# EAGLE design untitled (EAGLE 9.6.2)
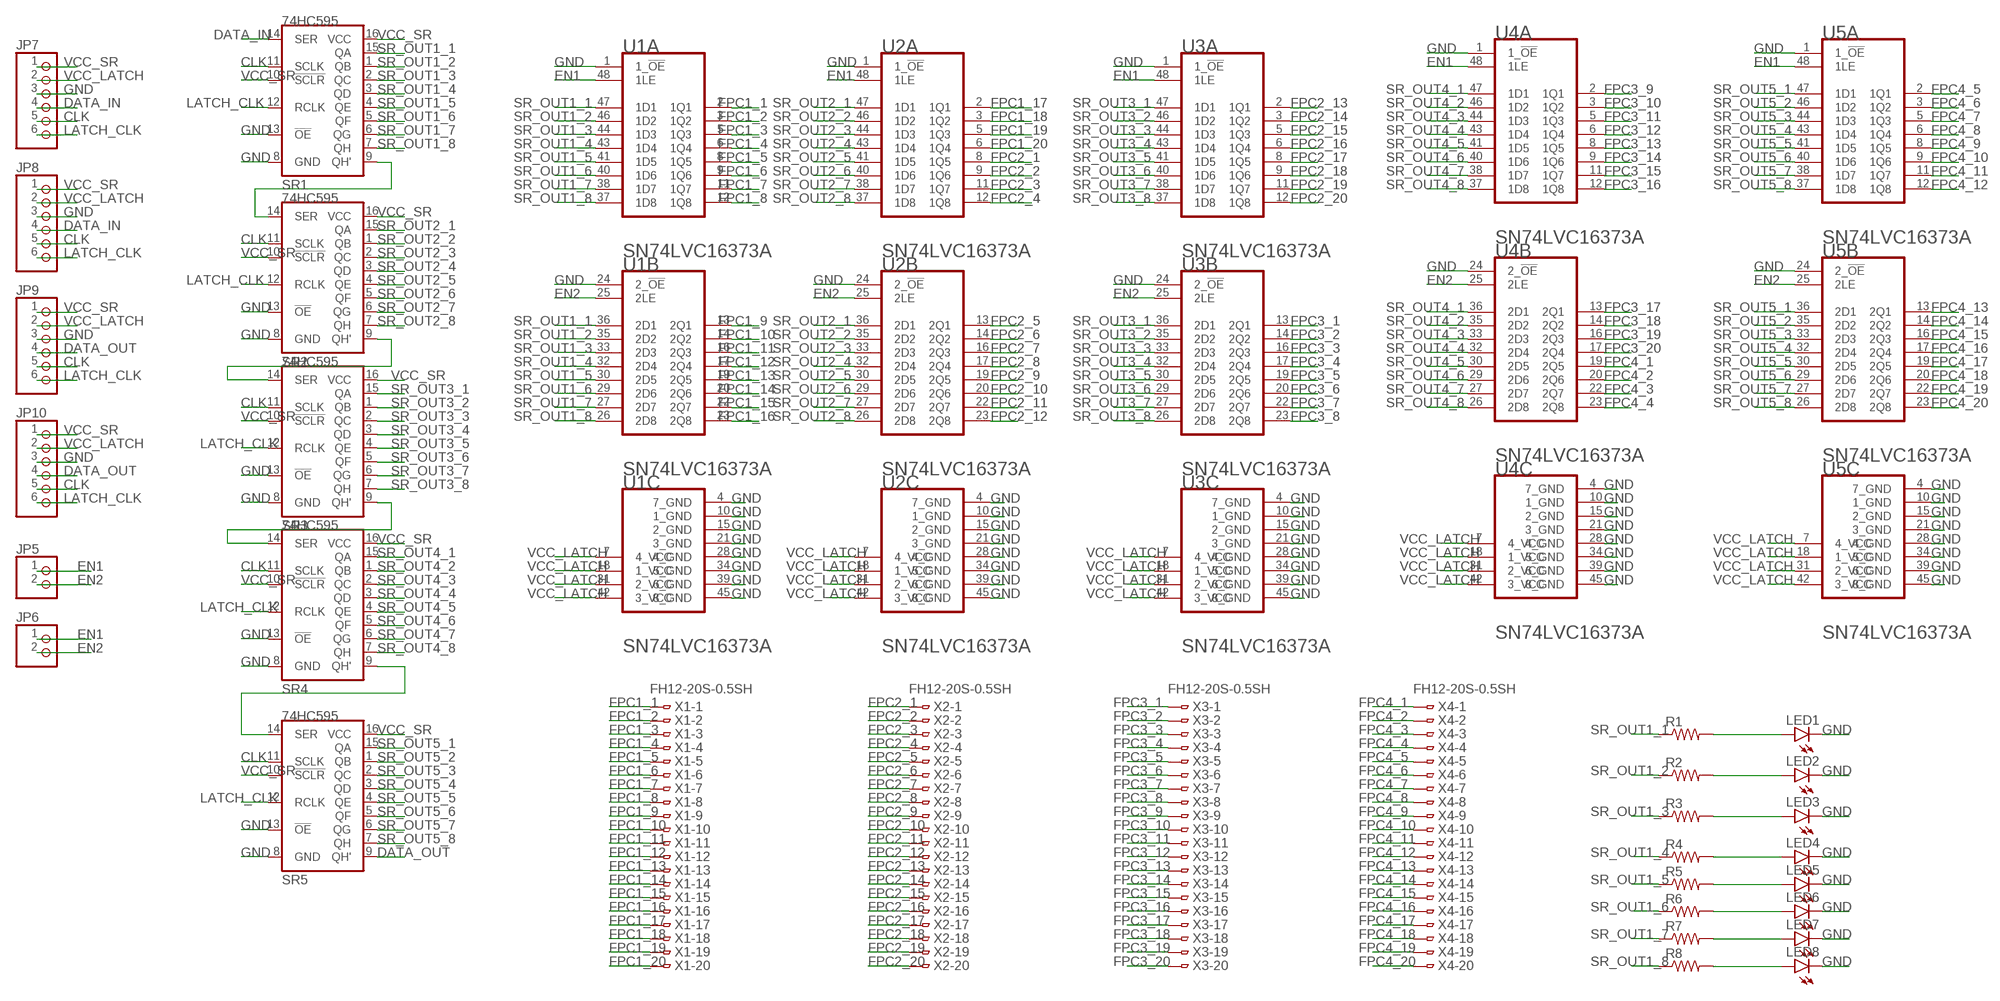
[diagram p0: schematic, sheet 1]

## Parts
JP5  PINHD-1X2  [1X02]
JP6  PINHD-1X2  [1X02]
JP7  PINHD-1X6  [1X06]
JP8  PINHD-1X6  [1X06]
JP9  PINHD-1X6  [1X06]
JP10  PINHD-1X6  [1X06]
LED1  LEDCHIP-LED0805  [CHIP-LED0805]
LED2  LEDCHIP-LED0805  [CHIP-LED0805]
LED3  LEDCHIP-LED0805  [CHIP-LED0805]
LED4  LEDCHIP-LED0805  [CHIP-LED0805]
LED5  LEDCHIP-LED0805  [CHIP-LED0805]
LED6  LEDCHIP-LED0805  [CHIP-LED0805]
LED7  LEDCHIP-LED0805  [CHIP-LED0805]
LED8  LEDCHIP-LED0805  [CHIP-LED0805]
R1  R-US_R0805  [R0805]
R2  R-US_R0805  [R0805]
R3  R-US_R0805  [R0805]
R4  R-US_R0805  [R0805]
R5  R-US_R0805  [R0805]
R6  R-US_R0805  [R0805]
R7  R-US_R0805  [R0805]
R8  R-US_R0805  [R0805]
SR1  74HC595  [SO16]
SR2  74HC595  [SO16]
SR3  74HC595  [SO16]
SR4  74HC595  [SO16]
SR5  74HC595  [SO16]
U1  TEXAS_INSTRUMENTS_SN74LVC16373ATEXAS_INSTRUMENTS_SN74LVC16373A_0_2  [TEXAS_INSTRUMENTS_SN74LVC16373A_2]
U2  TEXAS_INSTRUMENTS_SN74LVC16373ATEXAS_INSTRUMENTS_SN74LVC16373A_0_2  [TEXAS_INSTRUMENTS_SN74LVC16373A_2]
U3  TEXAS_INSTRUMENTS_SN74LVC16373ATEXAS_INSTRUMENTS_SN74LVC16373A_0_2  [TEXAS_INSTRUMENTS_SN74LVC16373A_2]
U4  TEXAS_INSTRUMENTS_SN74LVC16373ATEXAS_INSTRUMENTS_SN74LVC16373A_0_2  [TEXAS_INSTRUMENTS_SN74LVC16373A_2]
U5  TEXAS_INSTRUMENTS_SN74LVC16373ATEXAS_INSTRUMENTS_SN74LVC16373A_0_2  [TEXAS_INSTRUMENTS_SN74LVC16373A_2]
X1  FH12-20S-0.5SH  [FH12-20S-0.5SH]
X2  FH12-20S-0.5SH  [FH12-20S-0.5SH]
X3  FH12-20S-0.5SH  [FH12-20S-0.5SH]
X4  FH12-20S-0.5SH  [FH12-20S-0.5SH]

## Nets
CLK: JP7.5 JP8.5 JP9.5 JP10.5 SR1.11(SCLK) SR2.11(SCLK) SR3.11(SCLK) SR4.11(SCLK) SR5.11(SCLK)
DATA_IN: JP7.4 JP8.4 SR1.14(SER)
DATA_OUT: JP9.4 JP10.4 SR5.9(QH')
EN1: JP5.1 JP6.1 U1.48(A:1LE) U2.48(A:1LE) U3.48(A:1LE) U4.48(A:1LE) U5.48(A:1LE)
EN2: JP5.2 JP6.2 U1.25(B:2LE) U2.25(B:2LE) U3.25(B:2LE) U4.25(B:2LE) U5.25(B:2LE)
FPC1_1: U1.2(A:1Q1) X1.1
FPC1_2: U1.3(A:1Q2) X1.2
FPC1_3: U1.5(A:1Q3) X1.3
FPC1_4: U1.6(A:1Q4) X1.4
FPC1_5: U1.8(A:1Q5) X1.5
FPC1_6: U1.9(A:1Q6) X1.6
FPC1_7: U1.11(A:1Q7) X1.7
FPC1_8: U1.12(A:1Q8) X1.8
FPC1_9: U1.13(B:2Q1) X1.9
FPC1_10: U1.14(B:2Q2) X1.10
FPC1_11: U1.16(B:2Q3) X1.11
FPC1_12: U1.17(B:2Q4) X1.12
FPC1_13: U1.19(B:2Q5) X1.13
FPC1_14: U1.20(B:2Q6) X1.14
FPC1_15: U1.22(B:2Q7) X1.15
FPC1_16: U1.23(B:2Q8) X1.16
FPC1_17: U2.2(A:1Q1) X1.17
FPC1_18: U2.3(A:1Q2) X1.18
FPC1_19: U2.5(A:1Q3) X1.19
FPC1_20: U2.6(A:1Q4) X1.20
FPC2_1: U2.8(A:1Q5) X2.1
FPC2_2: U2.9(A:1Q6) X2.2
FPC2_3: U2.11(A:1Q7) X2.3
FPC2_4: U2.12(A:1Q8) X2.4
FPC2_5: U2.13(B:2Q1) X2.5
FPC2_6: U2.14(B:2Q2) X2.6
FPC2_7: U2.16(B:2Q3) X2.7
FPC2_8: U2.17(B:2Q4) X2.8
FPC2_9: U2.19(B:2Q5) X2.9
FPC2_10: U2.20(B:2Q6) X2.10
FPC2_11: U2.22(B:2Q7) X2.11
FPC2_12: U2.23(B:2Q8) X2.12
FPC2_13: U3.2(A:1Q1) X2.13
FPC2_14: U3.3(A:1Q2) X2.14
FPC2_15: U3.5(A:1Q3) X2.15
FPC2_16: U3.6(A:1Q4) X2.16
FPC2_17: U3.8(A:1Q5) X2.17
FPC2_18: U3.9(A:1Q6) X2.18
FPC2_19: U3.11(A:1Q7) X2.19
FPC2_20: U3.12(A:1Q8) X2.20
FPC3_1: U3.13(B:2Q1) X3.1
FPC3_2: U3.14(B:2Q2) X3.2
FPC3_3: U3.16(B:2Q3) X3.3
FPC3_4: U3.17(B:2Q4) X3.4
FPC3_5: U3.19(B:2Q5) X3.5
FPC3_6: U3.20(B:2Q6) X3.6
FPC3_7: U3.22(B:2Q7) X3.7
FPC3_8: U3.23(B:2Q8) X3.8
FPC3_9: U4.2(A:1Q1) X3.9
FPC3_10: U4.3(A:1Q2) X3.10
FPC3_11: U4.5(A:1Q3) X3.11
FPC3_12: U4.6(A:1Q4) X3.12
FPC3_13: U4.8(A:1Q5) X3.13
FPC3_14: U4.9(A:1Q6) X3.14
FPC3_15: U4.11(A:1Q7) X3.15
FPC3_16: U4.12(A:1Q8) X3.16
FPC3_17: U4.13(B:2Q1) X3.17
FPC3_18: U4.14(B:2Q2) X3.18
FPC3_19: U4.16(B:2Q3) X3.19
FPC3_20: U4.17(B:2Q4) X3.20
FPC4_1: U4.19(B:2Q5) X4.1
FPC4_2: U4.20(B:2Q6) X4.2
FPC4_3: U4.22(B:2Q7) X4.3
FPC4_4: U4.23(B:2Q8) X4.4
FPC4_5: U5.2(A:1Q1) X4.5
FPC4_6: U5.3(A:1Q2) X4.6
FPC4_7: U5.5(A:1Q3) X4.7
FPC4_8: U5.6(A:1Q4) X4.8
FPC4_9: U5.8(A:1Q5) X4.9
FPC4_10: U5.9(A:1Q6) X4.10
FPC4_11: U5.11(A:1Q7) X4.11
FPC4_12: U5.12(A:1Q8) X4.12
FPC4_13: U5.13(B:2Q1) X4.13
FPC4_14: U5.14(B:2Q2) X4.14
FPC4_15: U5.16(B:2Q3) X4.15
FPC4_16: U5.17(B:2Q4) X4.16
FPC4_17: U5.19(B:2Q5) X4.17
FPC4_18: U5.20(B:2Q6) X4.18
FPC4_19: U5.22(B:2Q7) X4.19
FPC4_20: U5.23(B:2Q8) X4.20
GND: JP7.3 JP8.3 JP9.3 JP10.3 LED1.C LED2.C LED3.C LED4.C LED5.C LED6.C LED7.C LED8.C SR1.8(GND) SR1.13(!OE) SR2.8(GND) SR2.13(!OE) SR3.8(GND) SR3.13(!OE) SR4.8(GND) SR4.13(!OE) SR5.8(GND) SR5.13(!OE) U1.1(A:1_!OE!) U1.4(C:7_GND) U1.10(C:1_GND) U1.15(C:2_GND) U1.21(C:3_GND) U1.24(B:2_!OE!) U1.28(C:4_GND) U1.34(C:5_GND) U1.39(C:6_GND) U1.45(C:8_GND) U2.1(A:1_!OE!) U2.4(C:7_GND) U2.10(C:1_GND) U2.15(C:2_GND) U2.21(C:3_GND) U2.24(B:2_!OE!) U2.28(C:4_GND) U2.34(C:5_GND) U2.39(C:6_GND) U2.45(C:8_GND) U3.1(A:1_!OE!) U3.4(C:7_GND) U3.10(C:1_GND) U3.15(C:2_GND) U3.21(C:3_GND) U3.24(B:2_!OE!) U3.28(C:4_GND) U3.34(C:5_GND) U3.39(C:6_GND) U3.45(C:8_GND) U4.1(A:1_!OE!) U4.4(C:7_GND) U4.10(C:1_GND) U4.15(C:2_GND) U4.21(C:3_GND) U4.24(B:2_!OE!) U4.28(C:4_GND) U4.34(C:5_GND) U4.39(C:6_GND) U4.45(C:8_GND) U5.1(A:1_!OE!) U5.4(C:7_GND) U5.10(C:1_GND) U5.15(C:2_GND) U5.21(C:3_GND) U5.24(B:2_!OE!) U5.28(C:4_GND) U5.34(C:5_GND) U5.39(C:6_GND) U5.45(C:8_GND)
LATCH_CLK: JP7.6 JP8.6 JP9.6 JP10.6 SR1.12(RCLK) SR2.12(RCLK) SR3.12(RCLK) SR4.12(RCLK) SR5.12(RCLK)
N$1: SR1.9(QH') SR2.14(SER)
N$2: SR4.9(QH') SR5.14(SER)
N$3: LED1.A R1.2
N$4: LED2.A R2.2
N$5: LED3.A R3.2
N$6: LED4.A R4.2
N$7: LED5.A R5.2
N$8: SR2.9(QH') SR3.14(SER)
N$9: LED6.A R6.2
N$10: LED7.A R7.2
N$11: LED8.A R8.2
N$15: SR3.9(QH') SR4.14(SER)
SR_OUT1_1: R1.1 SR1.15(QA) U1.36(B:2D1) U1.47(A:1D1)
SR_OUT1_2: R2.1 SR1.1(QB) U1.35(B:2D2) U1.46(A:1D2)
SR_OUT1_3: R3.1 SR1.2(QC) U1.33(B:2D3) U1.44(A:1D3)
SR_OUT1_4: R4.1 SR1.3(QD) U1.32(B:2D4) U1.43(A:1D4)
SR_OUT1_5: R5.1 SR1.4(QE) U1.30(B:2D5) U1.41(A:1D5)
SR_OUT1_6: R6.1 SR1.5(QF) U1.29(B:2D6) U1.40(A:1D6)
SR_OUT1_7: R7.1 SR1.6(QG) U1.27(B:2D7) U1.38(A:1D7)
SR_OUT1_8: R8.1 SR1.7(QH) U1.26(B:2D8) U1.37(A:1D8)
SR_OUT2_1: SR2.15(QA) U2.36(B:2D1) U2.47(A:1D1)
SR_OUT2_2: SR2.1(QB) U2.35(B:2D2) U2.46(A:1D2)
SR_OUT2_3: SR2.2(QC) U2.33(B:2D3) U2.44(A:1D3)
SR_OUT2_4: SR2.3(QD) U2.32(B:2D4) U2.43(A:1D4)
SR_OUT2_5: SR2.4(QE) U2.30(B:2D5) U2.41(A:1D5)
SR_OUT2_6: SR2.5(QF) U2.29(B:2D6) U2.40(A:1D6)
SR_OUT2_7: SR2.6(QG) U2.27(B:2D7) U2.38(A:1D7)
SR_OUT2_8: SR2.7(QH) U2.26(B:2D8) U2.37(A:1D8)
SR_OUT3_1: SR3.15(QA) U3.36(B:2D1) U3.47(A:1D1)
SR_OUT3_2: SR3.1(QB) U3.35(B:2D2) U3.46(A:1D2)
SR_OUT3_3: SR3.2(QC) U3.33(B:2D3) U3.44(A:1D3)
SR_OUT3_4: SR3.3(QD) U3.32(B:2D4) U3.43(A:1D4)
SR_OUT3_5: SR3.4(QE) U3.30(B:2D5) U3.41(A:1D5)
SR_OUT3_6: SR3.5(QF) U3.29(B:2D6) U3.40(A:1D6)
SR_OUT3_7: SR3.6(QG) U3.27(B:2D7) U3.38(A:1D7)
SR_OUT3_8: SR3.7(QH) U3.26(B:2D8) U3.37(A:1D8)
SR_OUT4_1: SR4.15(QA) U4.36(B:2D1) U4.47(A:1D1)
SR_OUT4_2: SR4.1(QB) U4.35(B:2D2) U4.46(A:1D2)
SR_OUT4_3: SR4.2(QC) U4.33(B:2D3) U4.44(A:1D3)
SR_OUT4_4: SR4.3(QD) U4.32(B:2D4) U4.43(A:1D4)
SR_OUT4_5: SR4.4(QE) U4.30(B:2D5) U4.41(A:1D5)
SR_OUT4_6: SR4.5(QF) U4.29(B:2D6) U4.40(A:1D6)
SR_OUT4_7: SR4.6(QG) U4.27(B:2D7) U4.38(A:1D7)
SR_OUT4_8: SR4.7(QH) U4.26(B:2D8) U4.37(A:1D8)
SR_OUT5_1: SR5.15(QA) U5.36(B:2D1) U5.47(A:1D1)
SR_OUT5_2: SR5.1(QB) U5.35(B:2D2) U5.46(A:1D2)
SR_OUT5_3: SR5.2(QC) U5.33(B:2D3) U5.44(A:1D3)
SR_OUT5_4: SR5.3(QD) U5.32(B:2D4) U5.43(A:1D4)
SR_OUT5_5: SR5.4(QE) U5.30(B:2D5) U5.41(A:1D5)
SR_OUT5_6: SR5.5(QF) U5.29(B:2D6) U5.40(A:1D6)
SR_OUT5_7: SR5.6(QG) U5.27(B:2D7) U5.38(A:1D7)
SR_OUT5_8: SR5.7(QH) U5.26(B:2D8) U5.37(A:1D8)
VCC_LATCH: JP7.2 JP8.2 JP9.2 JP10.2 U1.7(C:4_VCC) U1.18(C:1_VCC) U1.31(C:2_VCC) U1.42(C:3_VCC) U2.7(C:4_VCC) U2.18(C:1_VCC) U2.31(C:2_VCC) U2.42(C:3_VCC) U3.7(C:4_VCC) U3.18(C:1_VCC) U3.31(C:2_VCC) U3.42(C:3_VCC) U4.7(C:4_VCC) U4.18(C:1_VCC) U4.31(C:2_VCC) U4.42(C:3_VCC) U5.7(C:4_VCC) U5.18(C:1_VCC) U5.31(C:2_VCC) U5.42(C:3_VCC)
VCC_SR: JP7.1 JP8.1 JP9.1 JP10.1 SR1.10(!SCLR) SR1.16(VCC) SR2.10(!SCLR) SR2.16(VCC) SR3.10(!SCLR) SR3.16(VCC) SR4.10(!SCLR) SR4.16(VCC) SR5.10(!SCLR) SR5.16(VCC)

## Library data of the parts
JP5 JP6 = pinhead:PINHD-1X2: PIN HEADER
JP7-JP10 = pinhead:PINHD-1X6: PIN HEADER
LED1-LED8 = led:LED: LED OSRAM: - CHIPLED LG R971, LG N971, LY N971, LG Q971, LY Q971, LO R971, LY R971 LH N974, LH R974 LS Q976, LO Q976, LY Q976 LO Q996 - Hyper CHIPLED LW Q18S LB Q993, LB Q99A, LB R99A - SideLED LS A670, LO A670, LY A670, LG A670, LP A670 LB A673, LV A673, LT A673, LW A673 LH A674 LY A675 LS A676, LA A676, LO A676, LY A676, LW A676 LS A679, LY A679, LG A679 - Hyper Micro SIDELED® LS Y876, LA Y876, LO Y876, LY Y876 LT Y87S - SmartLED LW L88C, LW L88S LB L89C, LB L89S, LG L890 LS L89K, LO L89K, LY L89K LS L896, LA L896, LO L896, LY L896 - TOPLED LS T670, LO T670, LY T670, LG T670, LP T670 LSG T670, LSP T670, LSY T670, LOP T670, LYG T670 LG T671, LOG T671, LSG T671 LB T673, LV T673, LT T673, LW T673 LH T674 LS T676, LA T676, LO T676, LY T676, LB T676, LH T676, LSB T676, LW T676 LB T67C, LV T67C, LT T67C, LS T67K, LO T67K, LY T67K, LW E67C LS E67B, LA E67B, LO E67B, LY E67B, LB E67C, LV E67C, LT E67C LW T67C LS T679, LY T679, LG T679 LS T770, LO T770, LY T770, LG T770, LP T770 LB T773, LV T773, LT T773, LW T773 LH T774 LS E675, LA E675, LY E675, LS T675 LS T776, LA T776, LO T776, LY T776, LB T776 LHGB T686 LT T68C, LB T68C - Hyper Mini TOPLED® LB M676 - Mini TOPLED Santana® LG M470 LS M47K, LO M47K, LY M47K Source: http://www.osram.convergy.de LUXEON: - LUMILED® LXK2-PW12-R00, LXK2-PW12-S00, LXK2-PW14-U00, LXK2-PW14-V00 LXK2-PM12-R00, LXK2-PM12-S00, LXK2-PM14-U00 LXK2-PE12-Q00, LXK2-PE12-R00, LXK2-PE12-S00, LXK2-PE14-T00, LXK2-PE14-U00 LXK2-PB12-K00, LXK2-PB12-L00, LXK2-PB12-M00, LXK2-PB14-N00, LXK2-PB14-P00, LXK2-PB14-Q00 LXK2-PR12-L00, LXK2-PR12-M00, LXK2-PR14-Q00, LXK2-PR14-R00 LXK2-PD12-Q00, LXK2-PD12-R00, LXK2-PD12-S00 LXK2-PH12-R00, LXK2-PH12-S00 LXK2-PL12-P00, LXK2-PL12-Q00, LXK2-PL12-R00 Source: www.luxeon.com KINGBRIGHT: KA-3528ASYC Source: www.kingbright.com
R1-R8 = rcl:R-US_: RESISTOR, American symbol; SPICEPREFIX: R
SR1-SR5 = 74HC595:74HC595: 8-bit SHIFT REGISTER, output latch Check availability <https://pricing.snapeda.com/parts/74HC595/Nexperia/view-part?ref=eda>; AVAILABILITY: In Stock; DESCRIPTION: Shift Register Single 8-Bit Serial to Serial/Parallel 16-Pin SSOP T/R; MF: Nexperia; MP: 74HC595; PACKAGE: None; PRICE: None
U1-U5 = SN74LVC16373A(NEW_16BIT_LATCH):TEXAS_INSTRUMENTS_SN74LVC16373A: TI-SN54_74XXXXX16X373X-48; 3_STATE_OUTPUT: Yes; BITS: 16; CIIVA_IDS: 19307467; CODE__JEDEC: MO-153; DATASHEET_VERSION: SCAS755B; FOOTPRINT_VARIANT_NAME_0: Level C; FOOTPRINT_VARIANT_NAME_1: Level B; FOOTPRINT_VARIANT_NAME_2: Level A; F__NOM_VOLTAGEMAXMHZ: 100; ICC__NOM_VOLTAGEMAXMA: 0.02; IMPORTED: yes; IMPORTED_FROM: vault; IMPORT_TS: 1521844253; INPUT_TYPE: CMOS,TTL; LOGIC: true; MF: Texas Instruments; MPN: SN74LVC16373A; OPERATING_TEMPERATURE_RANGEC: -40 to 125,-40 to 85; OUTPUT_DRIVE_IOLIOHMAXMA: 24/-24; OUTPUT_LOGIC: Non-inverted; OUTPUT_TYPE: CMOS; PACKAGE: DGG0048A; PREFIX: U; RATING: Catalog; RELEASE_DATE: 1459328133; SCHMITT_TRIGGER: No; STATIC_CURRENT: 0.02; TECHNOLOGY_FAMILY: LVC; TPD__NOM_VOLTAGEMAXNS: 6.4,4.2,4.9; VAULT_GUID: 00FB3570-8383-4C82-A038-A58A20934C8C; VAULT_REVISION: B0EE8CD6-9ACA-4FFF-ACFC-C0240CF4C59E; VCC_MAX_V: 3.6; VCC_MIN_V: 1.65; VOLTAGE_NOM_V: 1.8,2.5,2.7,3.3
X1-X4 = con-hirose:FH12-20S-0.5S: 0.5mm Pitch Connectors For FPC/FFC Source: Data sheet <http://www.hirose.co.jp/cataloge_hp/e58605370.pdf>; MPN: FH12-20S-0.5SH(55); OC_FARNELL: 1324549; OC_NEWARK: 34M6166

## Board
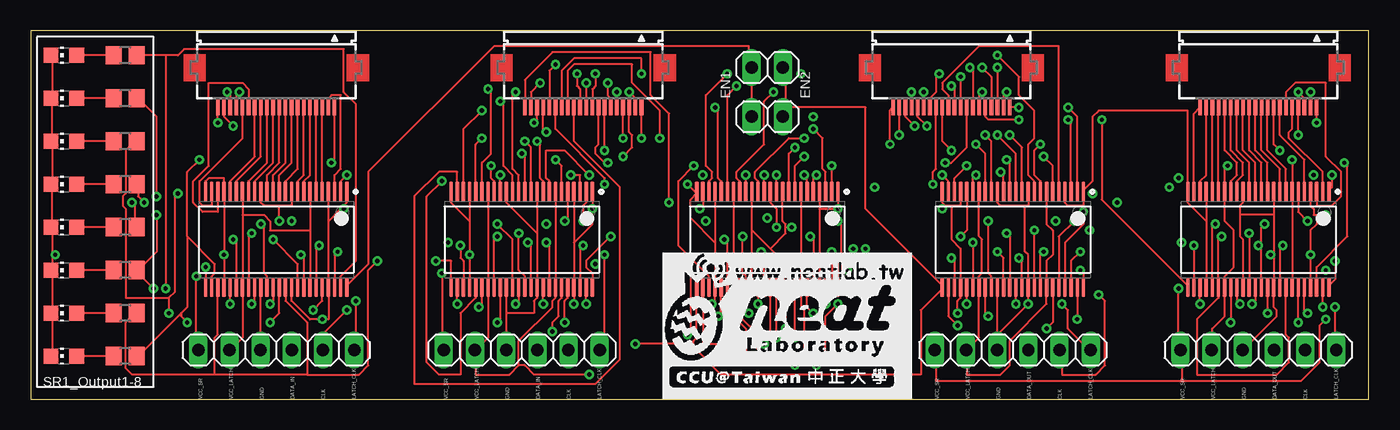
[diagram p1: board, top side]
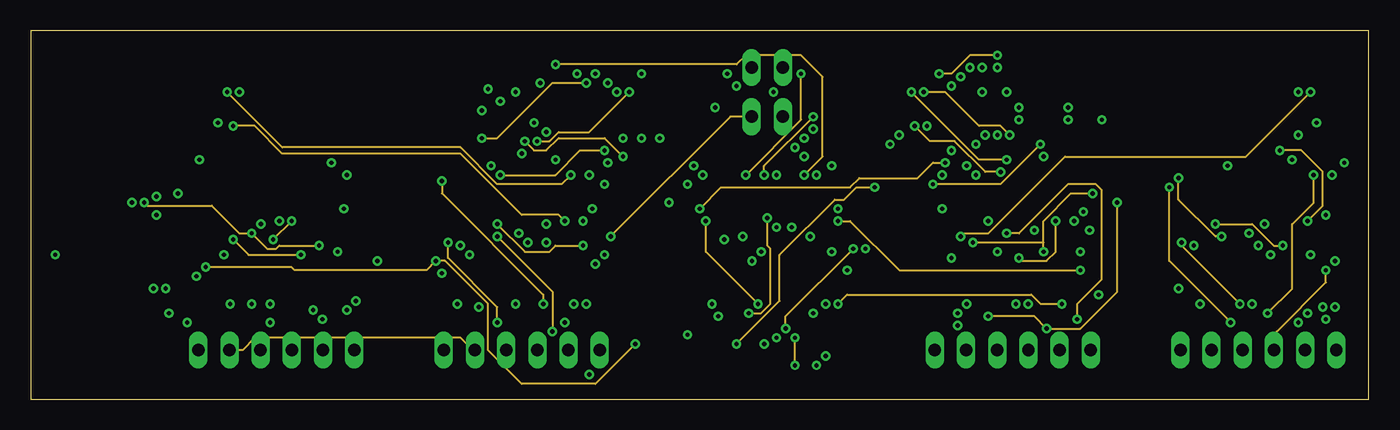
[diagram p2: board, inner layer Route2]
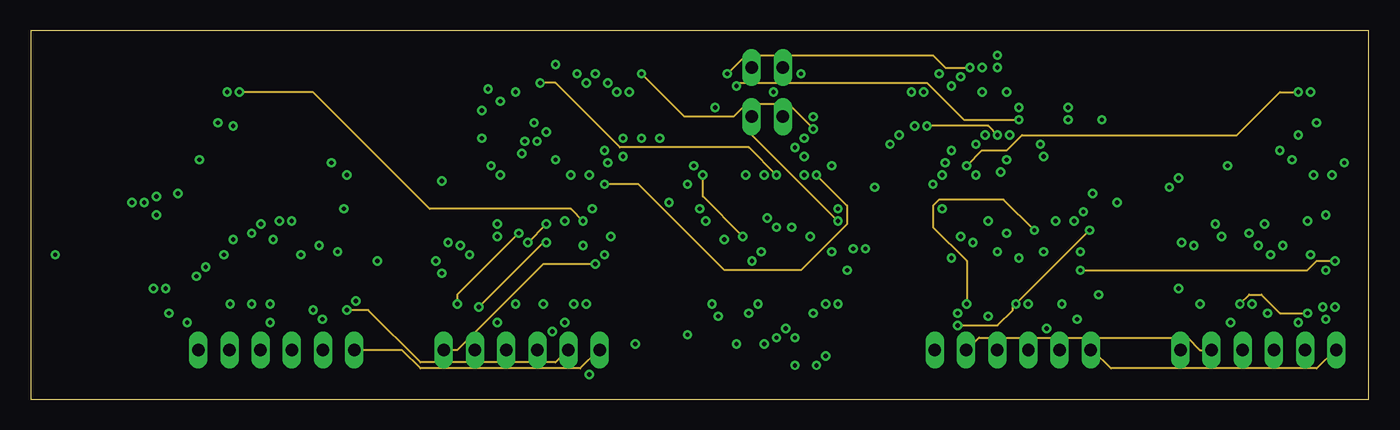
[diagram p3: board, inner layer Route15]
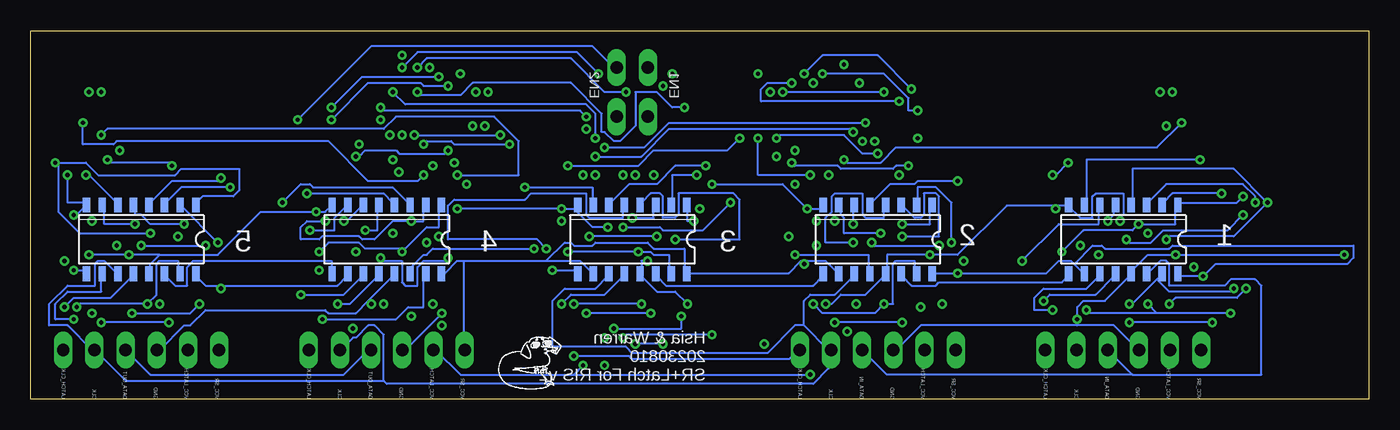
[diagram p4: board, bottom side, seen from below]

Size 109 x 30 mm. Coordinates in mm from the lower left corner, seen from the top.
Outline: 0,0 109,0 109,30 0,30 0,0
Copper layers (1+2*15+16): Top 0.035mm / dielectric 1.5mm / Route2 0.035mm / dielectric 0.15mm / Route15 0.035mm / dielectric 0.2mm / Bottom 0.035mm
Design rules "default *": minimum track width 6mil, minimum drill 0.35mm, track to track 6mil, track to pad 6mil, pad to pad 6mil, via to via 6mil, smd to smd 6mil, copper to edge 40mil, drill to drill 6mil, minimum pad ring 10mil, minimum via ring 8mil, stop-mask expansion 4mil, vias tented up to drill 0mil, thermal gap 10mil

### Footprints (pad centres in the part's own frame; a part is rotated, then mirrored left to right if it is on the bottom)
1X02 = drill 1.016 long: 1 -1.27,0; 2 1.27,0
1X06 = drill 1.016 long: 1 -6.35,0; 2 -3.81,0; 3 -1.27,0; 4 1.27,0; 5 3.81,0; 6 6.35,0
CHIP-LED0805 = smd 1.2 x 1.2: A 0,-1.05; C 0,1.05
R0805 = smd 1.3 x 1.5: 1 -0.95,0; 2 0.95,0
SO16 = smd 0.6 x 1.2: 1 -4.445,-2.8; 2 -3.175,-2.8; 3 -1.905,-2.8; 4 -0.635,-2.8; 5 0.635,-2.8; 6 1.905,-2.8; 7 3.175,-2.8; 8 4.445,-2.8; 9 4.445,2.8; 10 3.175,2.8; 11 1.905,2.8; 12 0.635,2.8; 13 -0.635,2.8; 14 -1.905,2.8; 15 -3.175,2.8; 16 -4.445,2.8
TEXAS_INSTRUMENTS_SN74LVC16373A_2 = smd 1.6 x 0.3: 1 -3.9,5.75; 2 -3.9,5.25; 3 -3.9,4.75; 4 -3.9,4.25; 5 -3.9,3.75; 6 -3.9,3.25; 7 -3.9,2.75; 8 -3.9,2.25; 9 -3.9,1.75; 10 -3.9,1.25; 11 -3.9,0.75; 12 -3.9,0.25; 13 -3.9,-0.25; 14 -3.9,-0.75; 15 -3.9,-1.25; 16 -3.9,-1.75; 17 -3.9,-2.25; 18 -3.9,-2.75; 19 -3.9,-3.25; 20 -3.9,-3.75; 21 -3.9,-4.25; 22 -3.9,-4.75; 23 -3.9,-5.25; 24 -3.9,-5.75; 25 3.9,-5.75; 26 3.9,-5.25; 27 3.9,-4.75; 28 3.9,-4.25; 29 3.9,-3.75; 30 3.9,-3.25; 31 3.9,-2.75; 32 3.9,-2.25; 33 3.9,-1.75; 34 3.9,-1.25; 35 3.9,-0.75; 36 3.9,-0.25; 37 3.9,0.25; 38 3.9,0.75; 39 3.9,1.25; 40 3.9,1.75; 41 3.9,2.25; 42 3.9,2.75; 43 3.9,3.25; 44 3.9,3.75; 45 3.9,4.25; 46 3.9,4.75; 47 3.9,5.25; 48 3.9,5.75
FH12-20S-0.5SH = smd 0.3 x 1.3: 1 -4.75,3.25; 2 -4.25,3.25; 3 -3.75,3.25; 4 -3.25,3.25; 5 -2.75,3.25; 6 -2.25,3.25; 7 -1.75,3.25; 8 -1.25,3.25; 9 -0.75,3.25; 10 -0.25,3.25; 11 0.25,3.25; 12 0.75,3.25; 13 1.25,3.25; 14 1.75,3.25; 15 2.25,3.25; 16 2.75,3.25; 17 3.25,3.25; 18 3.75,3.25; 19 4.25,3.25; 20 4.75,3.25

### Placement (x,y rotation side)
JP5  60,23 0 top
JP6  60,27 0 top
JP7  40,4 0 top
JP8  20,4 0 top
JP9  80,4 0 top
JP10  100,4 0 top
LED1  2.7,28 90 top
LED2  2.7,24.5 90 top
LED3  2.7,21 90 top
LED4  2.7,17.5 90 top
LED5  2.7,14 90 top
LED6  2.7,10.5 90 top
LED7  2.7,7 90 top
LED8  2.7,3.5 90 top
R1  7.7,28 180 top
R2  7.7,24.5 180 top
R3  7.7,21 180 top
R4  7.7,17.5 180 top
R5  7.7,14 180 top
R6  7.7,10.5 180 top
R7  7.7,7 180 top
R8  7.7,3.5 180 top
SR1  20,13 180 bottom
SR2  40,13 180 bottom
SR3  60,13 180 bottom
SR4  80,13 180 bottom
SR5  100,13 180 bottom
U1  20,13 270 top
U2  40,13 270 top
U3  60,13 270 top
U4  80,13 270 top
U5  100,13 270 top
U$1  [LOGO_SCALE_2.0]  51.5,0 0 top
X1  20,27 180 top
X2  45,27 180 top
X3  75,27 180 top
X4  100,27 180 top

### Tracks (layer width: path | path; a pad name or v marks a point on that pad's centre or on a via)
CLK  (via drill 0.35)
  Top 0.152: v87,8.5 87.5,8 87.5,2.75 86.75,2 84,2 84,4 JP9.5 | v25.75,7.25 24,5.5 24,4 JP8.5
  Route15 0.152: v25.75,7.25 27.5,7.25 31.75,3 42.75,3 43.75,4 JP7.5
  Bottom 0.152: v87,8.5 83.5,8.5 82,10 SR4.11 | SR5.11 102,10.25 103,11.25 103.5,11.25 103.75,11 103.75,9.25 106,9.25 107.5,7.75 107.5,6 106,6 104,4 JP10.5 103.75,4 101.25,1.5 80.25,1.5 | 80.25,1.5 80.25,5.25 81,6 81.5,6 82.5,5 82.75,5 83.75,4 JP9.5 | v25.75,7.25 27.25,7.25 27.25,8.25 26.5,9 23,9 22,10 SR1.11 | 46,6 46,8 45.5,8.5 43.5,8.5 42,10 SR2.11 | 44,4 46,6 | 46,6 46.75,6 49,3.75 60,3.75 60.5,4.25 66.5,4.25 66.5,8 65.5,9 63,9 62,10 SR3.11 | 80.25,1.5 80,1.25 45.25,1.25 44,2.5 44,4 | 44,4 JP7.5
DATA_IN
  Bottom 0.152: 19.25,2 8.75,2 8.75,9.25 9.25,9.75 11.25,9.75 11.75,9.25 16.25,9.25 16.25,11 16.5,11.25 17,11.25 18,10.25 SR1.14 | 19.25,2 21.25,4 JP8.4 | 19.25,2 39.25,2 41.25,4 JP7.4
DATA_OUT  (via drill 0.35)
  Route2 0.152: v105.5,10.5 105.5,9.5 101.5,5.5 101.5,4 JP10.4
  Bottom 0.152: v105.5,10.5 104.75,10.5 104.5,10.25 SR5.9 | JP9.4 81.5,4 83.5,2 99.25,2 101.25,4 JP10.4
EN1  (via drill 0.35)
  Top 0.152: U1.48 25.75,9.25 27.5,11 27.5,18.5 37.75,28.75 58.5,28.75 58.5,27 JP6.1 58.75,27 58.75,23 JP5.1 | U2.48 45.75,10.25 45.25,10.75 45.25,11.25 v47.25,13.25 | U3.48 65.75,11.5 66,11.75 66,14.25 v65.75,14.5 | U4.48 85.75,10.25 v85.5,10.5 | v106.25,11.25 106.25,9.75 105.75,9.25 U5.48
  Route2 0.152: v47.25,13.25 57,23 JP5.1 | v85.5,10.5 70.75,10.5 66.75,14.5 v65.75,14.5
  Route15 0.152: v65.75,14.5 58.75,21.5 58.75,23 JP5.1 | v106.25,11.25 104.75,11.25 104,10.5 v85.5,10.5
EN2  (via drill 0.35)
  Top 0.152: v87.25,22.75 87.25,16.25 94.25,9.25 U5.25 | 61.5,23.75 61.5,27 JP6.2 | 61.5,23.75 61.5,23 JP5.2 61.5,23.75 | v14.25,10.75 U1.25 | v33,11.25 34.25,11.25 U2.25 | U3.25 54.25,5 54,4.75 54,4.5 | 54,4.5 54,4.25 56.25,2 72.5,2 72.5,7.25 74.25,9 U4.25 74.25,9.25 68,15.5 68,23.75 61.5,23.75 | 54,4.5 v49.25,4.5
  Route2 0.152: v14.25,10.75 21.25,10.75 21.5,10.5 32.25,10.5 v33,11.25 33.75,11.25 37.25,7.75 37.25,4 40,1.25 46,1.25 v49.25,4.5
  Bottom 0.152: v87.25,22.75 81.25,28.75 63.25,28.75 61.5,27 JP6.2
FPC1_1  (via drill 0.35)
  Top 0.152: X1.1 24.75,19.5 v24.5,19.25 | v25.75,18.25 25.25,17.75 U1.2
  Bottom 0.152: v24.5,19.25 25.5,18.25 v25.75,18.25
FPC1_2
  Top 0.152: X1.2 24.25,24.5 24.5,24.75 25.25,24.75 25.25,18.75 24.75,18.25 U1.3
FPC1_3
  Top 0.152: U1.5 X1.3
FPC1_4
  Top 0.152: U1.6 X1.4
FPC1_5
  Top 0.152: X1.5 22.75,18.25 22.25,17.75 U1.8
FPC1_6
  Top 0.152: X1.6 22.25,18.25 21.75,17.75 U1.9
FPC1_7
  Top 0.152: X1.7 21.75,18.75 20.75,17.75 U1.11
FPC1_8
  Top 0.152: X1.8 21.25,19.25 20.25,18.25 U1.12
FPC1_9
  Top 0.152: X1.9 20.75,19.25 19.75,18.25 U1.13
FPC1_10
  Top 0.152: X1.10 20.25,19.25 19.25,18.25 U1.14
FPC1_11
  Top 0.152: X1.11 19.75,19.25 18.25,17.75 U1.16
FPC1_12
  Top 0.152: X1.12 19.25,19.25 17.75,17.75 U1.17
FPC1_13
  Top 0.152: X1.13 18.75,19.75 16.75,17.75 U1.19
FPC1_14
  Top 0.152: X1.14 18.25,19.75 16.25,17.75 U1.20
FPC1_15
  Top 0.152: X1.15 17.75,25.25 17.25,25.75 14.5,25.75 14.5,19 13.25,17.75 13.25,16 14,15.25 15.25,15.25 U1.22
FPC1_16
  Top 0.152: X1.16 17.25,21.25 13.75,17.75 13.75,16 14,15.75 14.75,15.75 U1.23
FPC1_17  (via drill 0.35)
  Top 0.152: X1.17 16.75,24.75 v17,25 | v45,14.5 45,15.75 45.25,16 U2.2
  Route15 0.152: v17,25 23,25 32.5,15.5 44,15.5 v45,14.5
FPC1_18  (via drill 0.35)
  Top 0.152: X1.18 16.25,24.75 v16,25 | v44,18.25 44.75,18.25 U2.3
  Route2 0.152: v16,25 20.5,20.5 35,20.5 38,17.5 43.25,17.5 v44,18.25
FPC1_19  (via drill 0.35)
  Top 0.152: X1.19 15.75,23 v16.5,22.25 | v43.5,14.5 43.75,14.75 U2.5
  Route2 0.152: v16.5,22.25 18.25,22.25 20.5,20 35,20 40,15 43,15 v43.5,14.5
FPC1_20  (via drill 0.35)
  Top 0.152: v15.25,22.5 X1.20 | v42.75,19.5 43.25,19 U2.6
  Bottom 0.152: v15.25,22.5 17.25,20.5 38.5,20.5 39.75,19.25 42.5,19.25 v42.75,19.5
FPC2_1  (via drill 0.35)
  Top 0.152: v49.75,21.25 X2.1 | v45.5,18.25 43.5,20.25 42,20.25 42,18 42.25,17.75 U2.8
  Bottom 0.152: v49.75,21.25 49.75,18.25 v45.5,18.25
FPC2_2  (via drill 0.35)
  Top 0.152: X2.2 49.25,24.5 v48.75,25 | v41.25,21 41.5,20.75 41.5,18 41.75,17.75 U2.9
  Route2 0.152: v48.75,25 45.5,21.75 43,21.75 42.25,21 v41.25,21
FPC2_3  (via drill 0.35)
  Top 0.152: X2.3 48.75,21.75 49,21.5 49,20.5 v48.25,19.75 | v40.25,21 40.75,20.5 U2.11
  Route2 0.152: v48.25,19.75 46.75,21.25 43,21.25 42,20.25 41,20.25 v40.25,21
FPC2_4  (via drill 0.35)
  Top 0.152: v48.25,21.25 X2.4 | v40,20 40.25,19.75 U2.12
  Bottom 0.152: v48.25,21.25 48,21.5 42.75,21.5 41.25,20 v40,20
FPC2_5  (via drill 0.35)
  Top 0.152: v47.75,25 X2.5 | v39.5,25 39.25,24.75 39.25,18.75 39.75,18.25 U2.13
  Bottom 0.152: v39.5,25 v47.75,25
FPC2_6  (via drill 0.35)
  Top 0.152: X2.6 47.25,24.5 47,24.75 v47,25.75 | v38.25,24.25 38.5,24 38.5,19 39.25,18.25 U2.14
  Bottom 0.152: v47,25.75 49,25.75 49.5,25.25 49.5,24.25 v38.25,24.25
FPC2_7  (via drill 0.35)
  Top 0.152: v46.75,20.25 X2.7 | U2.16 v38.25,18.25
  Route2 0.152: v46.75,20.25 44.75,20.25 42.75,18.25 v38.25,18.25
FPC2_8  (via drill 0.35)
  Top 0.152: X2.8 46.25,20.75 46,20.5 46,20 46.75,19.25 v47,19.25 | v37.5,19 37.5,18 37.75,17.75 U2.17
  Bottom 0.152: v47,19.25 46.75,19 43.25,19 43,18.75 38.75,18.75 38.5,19 v37.5,19
FPC2_9  (via drill 0.35)
  Top 0.152: X2.9 45.75,25.25 46,25.5 v46,26.5 | v37.25,25.25 37.5,25 37.5,20 36.75,19.25 U2.19
  Bottom 0.152: v46,26.5 44.5,28 40,28 v37.25,25.25
FPC2_10  (via drill 0.35)
  Top 0.152: v45.25,25.75 X2.10 | v36.75,21.25 36.25,20.75 U2.20
  Route2 0.152: v45.25,25.75 42.5,25.75 38,21.25 v36.75,21.25
FPC2_11  (via drill 0.35)
  Top 0.152: X2.11 44.75,25.25 44.5,25.5 v44.5,26.5 | v36.75,23.5 35.25,22 U2.22
  Bottom 0.152: v44.5,26.5 39.5,26.5 37.5,24.5 37.5,23.5 v36.75,23.5
FPC2_12
  Top 0.152: X2.12 44.25,21 48,17.25 48,3.25 46,1.25 31.25,1.25 31.25,16.5 33.25,18.5 34.75,18.5 U2.23
FPC2_13  (via drill 0.35)
  Top 0.152: X2.13 43.75,26.75 44.25,27.25 49,27.25 49,25.75 51.25,23.5 v51.25,21.25 | U3.2 v65.25,19
  Bottom 0.152: v51.25,21.25 52.25,20.25 58.25,20.25 59.5,19 v65.25,19
FPC2_14  (via drill 0.35)
  Top 0.152: X2.14 43.25,26.75 44.25,27.75 49.75,27.75 v49.75,26.5 | v63.75,22 64.5,21.25 64.5,18.75 64.75,18.5 U3.3
  Route15 0.152: v49.75,26.5 53.25,23 57.25,23 58.25,24 61.75,24 v63.75,22
FPC2_15  (via drill 0.35)
  Top 0.152: X2.15 42.75,22 46.75,18 v46.75,17.5 | v64,18.25 63.75,18 U3.5
  Route15 0.152: v46.75,17.5 49.5,17.5 56.5,10.5 62.75,10.5 66.5,14.25 66.5,15.75 v64,18.25
FPC2_16  (via drill 0.35)
  Top 0.152: X2.16 42.25,26.75 v42.75,27.25 | v63,18.25 63.25,18 U3.6
  Route2 0.152: v42.75,27.25 57.5,27.25 58.25,28 62.75,28 64.5,26.25 64.5,19.75 v63,18.25
FPC2_17  (via drill 0.35)
  Top 0.152: X2.17 41.75,22 v42,21.75 | v63,19.75 62.25,19 U3.8
  Bottom 0.152: v42,21.75 42.25,22 57,22 59.25,19.75 v63,19.75
FPC2_18  (via drill 0.35)
  Top 0.152: X2.18 41.25,22.75 v41,22.5 | v62.25,20.5 61.75,20 U3.9
  Bottom 0.152: v41,22.5 57,22.5 59,20.5 v62.25,20.5
FPC2_19  (via drill 0.35)
  Top 0.152: X2.19 40.75,25 v41.5,25.75 | U3.11 v60.75,18.25
  Route15 0.152: v41.5,25.75 42.75,25.75 48,20.5 58.5,20.5 v60.75,18.25
FPC2_20  (via drill 0.35)
  Top 0.152: X2.20 40.25,26 42.5,28.25 50.5,28.25 50.5,24.75 52,23.25 v52,16 | v60.75,14 60.75,15.5 60.25,16 U3.12
  Bottom 0.152: v52,16 54.25,13.75 57.5,13.75 57.75,14 v60.75,14
FPC3_1  (via drill 0.35)
  Top 0.152: v80.5,23.75 X3.1 | U3.13 v59.75,18.25
  Route2 0.152: v63.75,23 59.75,19 v59.75,18.25
  Bottom 0.152: v80.5,23.75 80.25,23.5 64.25,23.5 v63.75,23
FPC3_2  (via drill 0.35)
  Top 0.152: X3.2 79.25,24.75 v79.5,25 | v63,21.25 61.75,21.25 59,18.5 59,18 59.25,17.75 U3.14
  Bottom 0.152: v79.5,25 78.5,24 63.75,24 63,23.25 v63,21.25
FPC3_3  (via drill 0.35)
  Top 0.152: v78.75,27 X3.3 | U3.16 v58.25,18.25
  Route2 0.152: v62.75,26.5 62.75,22.75 v58.25,18.25
  Bottom 0.152: v78.75,27 77.5,28.25 64.5,28.25 v62.75,26.5
FPC3_4  (via drill 0.35)
  Top 0.152: X3.4 78.25,26.25 v77.5,27 | v60.5,25 59.75,24.25 59.75,20.75 57.5,18.5 57.5,18 57.75,17.75 U3.17
  Bottom 0.152: v77.5,27 76.75,27.75 65,27.75 62.25,25 v60.5,25
FPC3_5  (via drill 0.35)
  Top 0.152: X3.5 77.75,23 78,22.75 v80.5,22.75 | v57.5,25.5 56.75,24.75 U3.19
  Route15 0.152: v80.5,22.75 76,22.75 73,25.75 57.75,25.75 v57.5,25.5
FPC3_6  (via drill 0.35)
  Top 0.152: X3.6 77.25,24.75 v77.5,25 | v55.75,23.75 56,23.5 56,18 56.25,17.75 U3.20
  Bottom 0.152: v77.5,25 77.25,24.75 74,24.75 73,25.75 65,25.75 62.5,23.25 62.5,21.75 62.25,21.75 61.5,21 61,21 59.75,22.25 59.75,25 58,25 56.75,23.75 v55.75,23.75
FPC3_7  (via drill 0.35)
  Top 0.152: X3.7 76.75,26.75 v76.5,27 | v56.75,26.5 55,24.75 55,19 55.5,18.5 55.5,18 55.25,17.75 U3.22
  Route15 0.152: v76.5,27 74.5,27 73.5,28 58.25,28 v56.75,26.5
FPC3_8  (via drill 0.35)
  Top 0.152: X3.8 76.25,20.5 75,19.25 v74.5,19.25 | v54.5,15.5 54.75,15.75 U3.23
  Route2 0.152: v74.5,19.25 73.5,19.25 72.25,18 67.5,18 66.75,17.25 56.25,17.25 v54.5,15.5
FPC3_9  (via drill 0.35)
  Top 0.152: v75.75,26.25 X3.9 | v84.5,23.75 85.25,23 U4.2
  Bottom 0.152: v75.75,26.25 82,26.25 v84.5,23.75
FPC3_10  (via drill 0.35)
  Top 0.152: X3.10 75.25,25.25 v75,25.5 | v84.5,22.75 84.75,22.5 U4.3
  Bottom 0.152: v75,25.5 77,25.5 77.25,25.75 81.5,25.75 v84.5,22.75
FPC3_11
  Top 0.152: X3.11 74.75,24.75 74.25,25.25 74.25,25.75 77.25,28.75 83.75,28.75 U4.5
FPC3_12  (via drill 0.35)
  Top 0.152: X3.12 74.25,21 v75,20.25 | v82.5,19.75 83.25,19 U4.6
  Bottom 0.152: v75,20.25 75.25,20 79,20 79.25,20.25 81.75,20.25 82.25,19.75 v82.5,19.75
FPC3_13  (via drill 0.35)
  Top 0.152: X3.13 73.75,18.75 73.5,18.5 v73.5,17.5 | v82.25,20.75 81.75,20.25 81.75,18.25 82.25,17.75 U4.8
  Route2 0.152: v73.5,17.5 79,17.5 v82.25,20.75
FPC3_14  (via drill 0.35)
  Top 0.152: X3.14 73.25,24.5 73.75,25 73.75,26.25 v74,26.5 | v78.75,28 80.5,26.25 80.5,24.75 81.75,23.5 81.75,21.25 81.25,20.75 81.25,18.25 81.75,17.75 U4.9
  Route2 0.152: v74,26.5 75,26.5 76.5,28 v78.75,28
FPC3_15  (via drill 0.35)
  Top 0.152: v72.75,25 X3.15 | v79.75,21.5 80.75,20.5 U4.11
  Route2 0.152: v72.75,25 74.5,25 77.25,22.25 79,22.25 v79.75,21.5
FPC3_16  (via drill 0.35)
  Top 0.152: X3.16 72.25,23 v73,22.25 | v78.75,21.5 80.25,20 U4.12
  Route15 0.152: v73,22.25 78,22.25 v78.75,21.5
FPC3_17  (via drill 0.35)
  Top 0.152: v71.75,25 X3.17 | v79.5,19.5 79.75,19.25 U4.13
  Route2 0.152: v71.75,25 77.25,19.5 v79.5,19.5
FPC3_18  (via drill 0.35)
  Top 0.152: X3.18 71.25,23 v72,22.25 | v79,18.5 79.25,18.25 U4.14
  Route2 0.152: v72,22.25 73.25,21 75.25,21 77.75,18.5 v79,18.5
FPC3_19  (via drill 0.35)
  Top 0.152: v70.75,21.5 X3.19 | v77.75,21.5 78.25,21 U4.16
  Bottom 0.152: v77.75,21.5 v70.75,21.5
FPC3_20  (via drill 0.35)
  Top 0.152: X3.20 70,23.5 v70,20.75 | v77,20.75 77.75,20 U4.17
  Bottom 0.152: v70,20.75 74.5,20.75 74.75,21 76.75,21 v77,20.75
FPC4_1  (via drill 0.35)
  Top 0.152: v104.75,22.5 X4.1 | v77,18.25 76.75,18 U4.19
  Bottom 0.152: v104.75,22.5 104.75,20.75 102.25,20.75 102,21 84.75,21 81.5,17.75 77.5,17.75 v77,18.25
FPC4_2  (via drill 0.35)
  Top 0.152: v104.25,25 X4.2 | v75.75,13.25 76.25,13.75 U4.20
  Route2 0.152: v104.25,25 99,19.75 84.25,19.75 78,13.5 76,13.5 v75.75,13.25
FPC4_3  (via drill 0.35)
  Top 0.152: X4.3 103.75,24.5 v103.25,25 | v76.25,19 75.25,18 U4.22
  Route15 0.152: v103.25,25 101.75,25 98.25,21.5 80.75,21.5 79.5,20.25 77.5,20.25 v76.25,19
FPC4_4  (via drill 0.35)
  Top 0.152: v103.25,21.5 X4.4 | v74.25,18.25 74.75,17.75 U4.23
  Bottom 0.152: v103.25,21.5 102.75,22 80.25,22 79.25,23 71.25,23 69.25,21 69.25,18.25 v74.25,18.25
FPC4_5
  Top 0.152: X4.5 102.75,22 102.5,21.75 102.5,21.25 105.25,18.5 U5.2
FPC4_6
  Top 0.152: X4.6 102.25,25 103,25.75 105.5,25.75 105.5,19.75 106.75,18.5 106.75,16.5 106,15.75 104.75,15.75 U5.3
FPC4_7
  Top 0.152: X4.7 101.75,21.5 103.75,19.5 U5.5
FPC4_8  (via drill 0.35)
  Top 0.152: X4.8 101.25,20.75 v101.75,20.25 | v104,14.5 103.25,15.25 U5.6
  Route2 0.152: v101.75,20.25 103.5,20.25 105.25,18.5 105.25,15.75 v104,14.5
FPC4_9
  Top 0.152: X4.9 100.75,20.25 102.25,18.75 U5.8
FPC4_10
  Top 0.152: X4.10 100.25,20.25 101.75,18.75 U5.9
FPC4_11
  Top 0.152: X4.11 99.75,20.25 100.75,19.25 U5.11
FPC4_12
  Top 0.152: X4.12 99.25,20.25 100.25,19.25 U5.12
FPC4_13
  Top 0.152: X4.13 98.75,20.25 99.75,19.25 U5.13
FPC4_14
  Top 0.152: X4.14 98.25,20.25 99.25,19.25 U5.14
FPC4_15
  Top 0.152: X4.15 97.75,20.25 98.75,19.25 98.75,18.25 98.25,17.75 U5.16
FPC4_16
  Top 0.152: X4.16 97.25,20.25 98.25,19.25 98.25,18.25 97.75,17.75 U5.17
FPC4_17
  Top 0.152: U5.19 X4.17
FPC4_18
  Top 0.152: U5.20 X4.18
FPC4_19
  Top 0.152: X4.19 95.75,18.25 95.25,17.75 U5.22
FPC4_20
  Top 0.152: X4.20 94.75,23.25 U5.23
GND  (via drill 0.35)
  Top 0.152: U2.21 35.75,14.5 | 35.75,14.5 v35.75,11.75 U2.28 | U2.24 34.25,16 35.75,14.5 | U1.15 18.75,16 19,15.75 20.25,15.75 | 20.25,15.75 21.25,15.75 U1.10 | v20.25,14.5 20.25,15.75 | 1.75,24.5 1.75,28 LED1.C | 1.75,21 1.75,17.5 | 1.75,7 1.75,3.5 LED8.C | 1.75,14 1.75,11.75 | 1.75,11.75 1.75,10.5 | 1.75,10.5 1.75,7 | 1.75,7 LED7.C | 1.75,10.5 LED6.C | 1.75,14 1.75,17.5 | 1.75,17.5 LED4.C | 1.75,14 LED5.C | 1.75,21 1.75,24.5 | 1.75,24.5 LED2.C | 1.75,21 LED3.C | 38.75,7 38.75,4 JP7.3 | 38.75,7 U2.34 | U2.10 41.25,13.5 | 41.25,13.5 U2.39 41.25,8.25 41,8 41,7 38.75,7 | U2.15 38.75,16 41.25,13.5 | U1.39 21.25,8 22.75,6.5 v23.75,6.5 24.25,6.5 U1.45 24.25,14.5 | 24.25,14.5 U1.4 | U1.1 25.75,16 25.25,15.5 | 24.25,14.5 25.25,15.5 | U1.28 v15.75,11.75 U1.21 15.75,18 14.5,18 14.25,17.75 U1.24 | U1.34 18.75,4 JP8.3 | v2,11.75 1.75,11.75 | 25.25,15.5 v25.5,15.5 | U2.1 v45.75,15.5 45.75,14.25 44.25,12.75 | U2.4 44.25,12.75 | 44.25,12.75 U2.45 v44.25,7.75 | U3.21 55.75,12.75 | 55.75,12.75 U3.28 55.75,8 v55.5,7.75 | 54.25,16.75 53.75,16.25 53.75,14.75 55.75,12.75 | 54.25,16.75 v53.5,17.5 | 54.25,16.75 U3.24 | U4.24 74.25,16 74.5,15.75 | 75,15.75 75.75,15.75 U4.21 | 75,15.75 74.5,15.75 | 75,15.75 75,13 75.75,12.25 U4.28 75.75,8.25 75.5,8 v75.5,7 | U3.1 v65.75,15.5 64.25,15.5 | U3.4 64.25,15.5 | 64.25,15.5 U3.45 | U3.34 v58.75,11.25 58.75,13.75 | 58.75,13.75 U3.15 | U3.39 61.25,11.25 60.25,12.25 | 58.75,13.75 60.25,12.25 | U3.10 61.25,14.5 61.5,14.25 61.5,14 | 61.5,14 61.5,13.5 60.25,12.25 | 61.5,14 v62,14 | v74.25,15.5 74.5,15.75 | U4.45 84.25,12.75 85.75,14.25 v85.75,15.25 85.75,15.75 | 85.75,15.75 U4.1 85.75,17 86.5,17.75 86.5,23 87,23.5 94.25,23.5 U5.24 94.25,16 95.75,14.5
  Top 0.152: U4.4 84.25,16 84.5,15.75 85.75,15.75 | U5.21 95.75,14.5 | 95.75,14.5 U5.28 | 104.75,15 104.5,15 104.5,15.5 104.25,15.75 U5.4 | 104.75,15 v105.5,15 | U5.45 v104.25,11.75 104.25,13.75 104.75,14.25 104.75,15 | v106,18.25 106,17.25 105.75,17 U5.1 | U4.15 78.75,16 79,15.75 81,15.75 | 81,15.75 81.25,15.75 U4.10 | 78.75,5.25 78.75,4 JP9.3 78.75,5.25 | 78.75,5.25 U4.34 | 78.75,5.25 v81.25,7.75 U4.39 81.25,11.75 81,12 81,15.75 | U5.34 98.75,13 98.5,13.25 98.5,15 | 98.5,15 98.5,15.75 98.75,16 U5.15 | U5.10 101.25,15 | 101.25,15 101.25,11.75 | 101.25,11.75 U5.39 101.25,7.5 101.5,7.25 101.5,6.75 98.75,4 JP10.3 | 101.25,15 98.5,15 | 101.25,11.75 v101,11.75
  Bottom 0.152: 24.5,15.75 25.5,15.75 | 25.5,15.75 29.5,15.75 33.5,11.75 v35.75,11.75 39.25,11.75 39.25,10.25 SR2.13 39.5,10 41,8.5 43,8.5 43.75,7.75 v44.25,7.75 | v20.25,14.5 20.25,14.75 20,15 20,16.75 22.25,16.75 22.5,16.5 22.5,14.75 23.5,14.75 24.5,15.75 | 24.5,15.75 SR1.8 | 23.75,6 v23.75,6.5 23.75,7.5 23.25,8 21.5,8 19.5,10 SR1.13 19.5,10.25 18,11.75 v15.75,11.75 v2,11.75 | 23.75,6 20.75,6 18.75,4 JP8.3 | 23.75,6 36.5,6 38.5,4 JP7.3 | v25.5,15.5 25.5,15.75 | SR2.8 44.5,15.75 44.75,15.5 v45.75,15.5 47.75,17.5 v53.5,17.5 | 64.75,15.5 64.5,15.75 SR3.8 | 64.75,15.5 v65.75,15.5 v74.25,15.5 | v58.75,11.25 59.25,11.25 59.25,10.25 SR3.13 59.25,10 58,8.75 56.5,8.75 v55.5,7.75 | 64.75,15.5 63.25,14 v62,14 | v105.5,15 105.25,15 104.5,15.75 SR5.8 104.5,16 106,16 v106,18.25 | 98.5,11.75 93.75,11.75 90.25,15.25 v85.75,15.25 85,15.25 84.5,15.75 SR4.8 | 98.5,11.75 99.25,11 99.25,10.25 SR5.13 | 98.5,11.75 v101,11.75 v104.25,11.75 | 81.5,8 82.5,7 84.75,7 85,7.25 94.75,7.25 96,6 96.5,6 98.5,4 JP10.3 | 81.5,8 79.5,10 SR4.13 | 81.5,8 v81.25,7.75 | v75.5,7 78.5,4 JP9.3
LATCH_CLK  (via drill 0.35)
  Top 0.152: v84,7.75 84.5,7.25 84.5,5.75 86.25,4 JP9.6 | v106.25,7.5 106.25,4 JP10.6 | v26.5,8 26.5,4 JP8.6 | v46.75,11.75 46.75,4.25 46.5,4 JP7.6 | v65.75,7.75 64.75,6.75 v64.75,3.5
  Route2 0.152: v84,7.75 82.25,7.75 81.5,8.5 66.5,8.5 v65.75,7.75
  Route15 0.152: JP9.6 86.5,4 88,2.5 104.75,2.5 106.25,4 JP10.6 | JP8.6 30.25,4 31.75,2.5 44.75,2.5 46.25,4 JP7.6
  Bottom 0.152: v84,7.75 83,7.75 80.75,10 SR4.12 | v106.25,7.5 105.5,8.25 102.5,8.25 100.75,10 SR5.12 | v26.5,8 26,8.5 22.25,8.5 20.75,10 SR1.12 | v46.75,11.75 40.75,11.75 40.75,10.25 SR2.12 | v65.75,7.75 65,8.5 62.25,8.5 60.75,10 SR3.12 | v64.75,3.5 60.25,3.5 60,3.25 47.25,3.25 46.5,4 JP7.6
N$1
  Bottom 0.152: SR1.9 24.5,10 25,9.5 35,9.5 35.25,9.25 37.25,9.25 38,10 SR2.14
N$2
  Bottom 0.152: SR4.9 84.5,10.25 84.5,11.25 95.75,11.25 96.25,10.75 96.25,9.25 97.25,9.25 98,10 SR5.14
N$3
  Top 0.152: R1.2 LED1.A
N$4
  Top 0.152: R2.2 LED2.A
N$5
  Top 0.152: R3.2 LED3.A
N$6
  Top 0.152: R4.2 LED4.A
N$7
  Top 0.152: R5.2 LED5.A
N$8
  Bottom 0.152: SR2.9 44.5,10 45.25,9.25 57.25,9.25 58,10 SR3.14
N$9
  Top 0.152: R6.2 LED6.A
N$10
  Top 0.152: R7.2 LED7.A
N$11
  Top 0.152: R8.2 LED8.A
N$15  (via drill 0.35)
  Top 0.152: v66.5,10.5 68,12 v68,12.25
  Bottom 0.152: v66.5,10.5 64.75,10.5 64.5,10.25 SR3.9 | v68,12.25 76.25,12.25 76.75,11.75 77,11.75 78,10.75 78,10.25 SR4.14
SR_OUT1_1  (via drill 0.35)
  Top 0.152: v19.5,7.75 19.75,8 U1.36 | 11,28 12,28 12.5,28.5 25.5,28.5 25.5,25 26.5,24 26.5,11.25 25.25,10 U1.47 | 11,28 R1.1 | 11,28 v11,9
  Bottom 0.152: 17.25,9.75 19.25,7.75 v19.5,7.75 | 17.25,9.75 17,10 SR1.15 | 17.25,9.75 16.25,8.75 11.25,8.75 v11,9
SR_OUT1_2  (via drill 0.35)
  Top 0.152: v18.75,14.25 19,14 19,10.25 19.25,10 U1.35 | v10.25,16.5 10.25,23 8.75,24.5 R2.1 | U1.46 24.75,11.75 v25,12
  Bottom 0.152: v10.25,16.5 10.75,16 15.5,16 SR1.1 15.75,15.75 15.75,14.25 v18.75,14.25 19.25,13.75 23.25,13.75 v25,12
SR_OUT1_3  (via drill 0.35)
  Top 0.152: v12,16.75 11.75,16.5 11.75,8.75 11.25,8.25 | 11.25,8.25 7.75,8.25 7.75,15.5 7.5,15.75 7.5,16.5 7.75,16.75 7.75,20.25 8.5,21 R3.1 | U1.33 18.25,8 v18,7.75 | 11.25,8.25 v11.25,7 | U1.44 23.75,8 v23,7.25
  Bottom 0.152: v12,16.75 16,16.75 16.75,16 SR1.2 | 17.25,7 v18,7.75 | v11.25,7 17.25,7 | v23,7.25 22.75,7 17.25,7
SR_OUT1_4  (via drill 0.35)
  Top 0.152: v9.25,16 8.75,16.5 8.75,17.5 R4.1 | U1.32 17.75,13.25 v18,13.5 | U1.43 23.25,12.25 v23.5,12.5
  Route2 0.152: v9.25,16 9.5,15.75 14.75,15.75 17,13.5 v18,13.5 19.25,12.25 20,12.25 20.25,12.5 v23.5,12.5
  Bottom 0.152: v9.25,16 9.25,16.5 10.25,17.5 16.5,17.5 18,16 SR1.3
SR_OUT1_5  (via drill 0.35)
  Top 0.152: v8.25,16 8.5,15.75 8.5,14 R5.1 | U1.30 16.75,12.75 v16.5,13 | U1.41 22.25,11.5 v22,11.75
  Route2 0.152: v22,11.75 17.75,11.75 v16.5,13
  Bottom 0.152: SR1.4 19.25,16 19.25,18.75 11,18.75 v8.25,16 11,13.25 16.25,13.25 v16.5,13
SR_OUT1_6  (via drill 0.35)
  Top 0.152: v19.75,13 21.75,11 U1.40 | 8.75,10.5 10.25,12 v10.25,15 | v16.25,7.75 U1.29 | v10,9 8.75,10.25 8.75,10.5 | 8.75,10.5 R6.1
  Route2 0.152: v19.75,13 v21.25,14.5
  Bottom 0.152: v21.25,14.5 20.75,15 20.75,15.75 SR1.5 | v10.25,15 11.5,13.75 16.75,13.75 17.75,12.75 19.5,12.75 v19.75,13 | v16.25,7.75 15.75,8.25 10.75,8.25 v10,9
SR_OUT1_7  (via drill 0.35)
  Top 0.152: v28.25,11.25 27.5,10.5 27.5,2.75 26.75,2 22.5,2 | 22.5,2 22.5,6.25 20.75,8 U1.38 | 22.5,2 15,2 | 15,2 8.25,2 7.75,2.5 7.75,6.25 8.5,7 R7.1 | U1.27 15.25,5.25 15,5 15,2
  Bottom 0.152: v28.25,11.25 25.25,14.25 22,14.25 22,15.75 SR1.6
SR_OUT1_8  (via drill 0.35)
  Top 0.152: v13.75,19.5 12.75,18.5 12.75,13.25 | 12.75,13.25 15,11 15,10.25 14.75,10 U1.26 | 12.25,7 12.75,7.5 12.75,13.25 | 12.25,7 8.75,3.5 R8.1 | U1.37 20.25,7 v19.5,6.25 | v12.75,6.25 12.25,6.75 12.25,7
  Bottom 0.152: v13.75,19.5 23,19.5 23,16 SR1.7 | v12.75,6.25 v19.5,6.25
SR_OUT2_1  (via drill 0.35)
  Top 0.152: v39.5,7.75 39.75,8 U2.36 | v45.25,7.75 U2.47
  Bottom 0.152: SR2.15 37,10.25 37,11.25 38.5,11.25 38.75,11 38.75,7.75 v39.5,7.75 40.25,7 44.5,7 v45.25,7.75
SR_OUT2_2  (via drill 0.35)
  Top 0.152: v38,14.25 39.25,13 U2.35 | U2.46 44.75,12.25 v45,12.5
  Route2 0.152: v45,12.5 42.75,12.5 42.25,12 40.25,12 v38,14.25
  Bottom 0.152: v38,14.25 35.75,14.25 35.75,15.75 SR2.1
SR_OUT2_3  (via drill 0.35)
  Top 0.152: v38,6.25 38.25,6.5 U2.33 | U2.44 43.75,8.25 43.5,8 v43.5,6.25
  Route2 0.152: v34,12.75 34,11.5 38,7.5 v38,6.25
  Bottom 0.152: v34,12.75 34,16 35.25,17.25 36.75,17.25 36.75,16 SR2.2 | v38,6.25 v43.5,6.25
SR_OUT2_4  (via drill 0.35)
  Top 0.152: v38,13.25 37.75,13 U2.32 | U2.43 43.25,8.25 43,8 43,6.75 42.5,6.25 v42.5,5.5
  Route2 0.152: v42.5,5.5 42.5,8.75 v38,13.25
  Bottom 0.152: v38,13.25 35,13.25 35,16.5 35.25,16.75 36.25,16.75 36.25,15 36.5,14.75 37,14.75 38,15.75 SR2.3
SR_OUT2_5  (via drill 0.35)
  Top 0.152: v42,12.75 42.25,12.5 U2.41 | U2.30 36.75,7.75 v36.5,7.5
  Route15 0.152: v36.5,7.5 41.75,12.75 v42,12.75
  Bottom 0.152: v42,12.75 44.25,12.75 44.25,14.75 43.75,15.25 43.75,16.5 43.5,16.75 41.25,16.75 41.25,15 41,14.75 39.5,14.75 39.5,15.75 SR2.4
SR_OUT2_6  (via drill 0.35)
  Top 0.152: v33.5,17.75 32.25,16.5 32.25,3 33.25,2 35,2 35,7 36.25,8.25 U2.29 | v41.75,7.75 U2.40
  Route2 0.152: v41.75,7.75 41.75,8.5 33.5,16.75 v33.5,17.75
  Bottom 0.152: v33.5,17.75 36.75,17.75 37,17.5 39,17.5 40.5,16 SR2.5
SR_OUT2_7  (via drill 0.35)
  Top 0.152: v40.5,12.75 40.75,12.5 U2.38 | U2.27 35.25,11.25 35,11.5 v35,12.5
  Route15 0.152: v40.5,12.75 v42,14.25
  Bottom 0.152: v42,14.25 42,15.75 SR2.6 | v35,12.5 40.25,12.5 v40.5,12.75
SR_OUT2_8  (via drill 0.35)
  Top 0.152: v39.75,13.5 39.75,10.5 40.25,10 U2.37 | v34.75,7.75 U2.26
  Route15 0.152: v34.75,7.75 34.75,8.5 v39.75,13.5
  Bottom 0.152: v39.75,13.5 42.75,13.5 42.75,14.75 43,15 43,15.75 SR2.7
SR_OUT3_1  (via drill 0.35)
  Top 0.152: v59.5,12 59.75,11.75 U3.36 | v65.25,12 U3.47
  Bottom 0.152: SR3.15 57,10.25 57,11.75 58.25,11.75 58.5,12 v59.5,12 v65.25,12
SR_OUT3_2  (via drill 0.35)
  Top 0.152: U3.35 v59.25,7.75 | v64.75,7.75 U3.46
  Route2 0.152: v55,14.5 55,12 v59.25,7.75
  Bottom 0.152: v55,14.5 55.5,14.5 55.5,15.75 SR3.1 | v59.25,7.75 v64.75,7.75
SR_OUT3_3  (via drill 0.35)
  Top 0.152: v58,13.25 58,10.25 58.25,10 U3.33 | U3.44 63.75,13 v63.5,13.25
  Route15 0.152: v54.75,18.25 54.75,16.5 v58,13.25
  Bottom 0.152: v54.75,18.25 56.75,18.25 56.75,16 SR3.2 | v58,13.25 v63.5,13.25
SR_OUT3_4  (via drill 0.35)
  Top 0.152: v58.5,7 57.75,7.75 U3.32 | U3.43 63.25,7.5 v63.75,7
  Route2 0.152: v60,14.75 60,12.5 60.25,12.25 60.25,7.75 59.5,7 v58.5,7
  Bottom 0.152: v60,14.75 58.25,14.75 58.25,15.75 SR3.3 | v58.5,7 v63.75,7
SR_OUT3_5  (via drill 0.35)
  Top 0.152: v56.5,13 56.75,12.75 U3.30 56.75,7.25 58.25,5.75 58.25,2.75 v62.25,2.75 | v62.25,5 U3.41
  Route2 0.152: v62.25,2.75 v62.25,5
  Bottom 0.152: v56.5,13 51.25,13 51.25,16.25 51.75,16.75 56.25,16.75 56.25,15 56.5,14.75 57.5,14.75 57.5,16.5 57.75,16.75 58.5,16.75 59.25,16 SR3.4
SR_OUT3_6  (via drill 0.35)
  Top 0.152: v61.5,5.75 61.5,8 61.75,8.25 U3.40 | U3.29 56.25,7 v56,6.75
  Route2 0.152: v67,12.25 61.5,6.75 v61.5,5.75
  Bottom 0.152: v67,12.25 67.75,13 75,13 75,15.75 74.5,16.25 68.75,16.25 68.25,16.75 63.75,16.75 63.75,15 63.5,14.75 60.75,14.75 60.75,15.75 SR3.5 | v56,6.75 56,5.75 v61.5,5.75
SR_OUT3_7  (via drill 0.35)
  Top 0.152: v54,19 52.75,17.75 52.75,12.5 53.75,11.5 | 53.75,11.5 55.25,10 U3.27 | v60.75,5 U3.38 | v53.5,5.25 53.75,5.5 53.75,11.5
  Bottom 0.152: v54,19 56.5,19 58,17.5 60.25,17.5 61.75,16 SR3.6 | v60.75,5 60.5,5.25 v53.5,5.25
SR_OUT3_8  (via drill 0.35)
  Top 0.152: v57.5,4.5 54.75,4.5 U3.26 | U3.37 60.25,5.5 59.75,5 v59.75,4.5
  Route2 0.152: v68.75,17.25 67.25,17.25 66.25,16.25 65.5,16.25 61,11.75 61,8 v57.5,4.5
  Bottom 0.152: v68.75,17.25 63.25,17.25 63.25,16 SR3.7 | v57.5,4.5 v59.75,4.5
SR_OUT4_1  (via drill 0.35)
  Top 0.152: U4.47 v85.25,6.5 | U4.36 79.75,13.25 v79.5,13.5
  Route2 0.152: v79.5,13.5 80.5,13.5 84.5,17.5 86.75,17.5 87.25,17 87.25,9.75 85.25,7.75 v85.25,6.5
  Bottom 0.152: v85.25,6.5 79.25,6.5 78.25,7.5 77,7.5 77,10 SR4.15
SR_OUT4_2  (via drill 0.35)
  Top 0.152: v78.75,12 79.25,11.5 U4.35 | U4.46 84.75,11.25 v85.5,12
  Bottom 0.152: 78.5,12.25 76.75,14 75.75,14 75.75,15.75 SR4.1 | v85.5,12 84.75,12.75 82.25,12.75 81.75,12.25 78.5,12.25 | 78.5,12.25 v78.75,12
SR_OUT4_3  (via drill 0.35)
  Top 0.152: v78,14.5 78,10.25 78.25,10 U4.33 | U4.44 83.75,13.25 v85,14.5
  Bottom 0.152: SR4.2 77,15.75 77,14.5 v78,14.5 79.5,14.5 81,13 82,13 82.25,13.25 85.25,13.25 85.5,13 87,13 87,14 86.5,14.5 v85,14.5
SR_OUT4_4  (via drill 0.35)
  Top 0.152: v82.75,5.75 83.25,6.25 U4.43 | U4.32 77.75,7 v78,6.75
  Route2 0.152: v88.5,16 88.5,8.75 85.5,5.75 v82.75,5.75 81.75,6.75 v78,6.75
  Bottom 0.152: v88.5,16 87,17.5 86.25,17.5 86,17.25 79.5,17.25 78.25,16 SR4.3
SR_OUT4_5  (via drill 0.35)
  Top 0.152: v82.5,12 82.25,11.75 U4.41 | v76.75,12.75 U4.30
  Route2 0.152: v86.5,16.75 84.75,16.75 82.5,14.5 82.5,12.75 | v82.5,12 82.5,12.75 | 82.5,12.75 v76.75,12.75
  Bottom 0.152: v86.5,16.75 80.25,16.75 79.5,16 SR4.4
SR_OUT4_6  (via drill 0.35)
  Top 0.152: U4.40 v81.75,13.75 | v76.25,7.75 U4.29
  Route15 0.152: v76.25,7.75 76.25,11.25 73.5,14 73.5,15.75 74,16.25 79.25,16.25 v81.75,13.75
  Bottom 0.152: v81.75,13.75 80.75,13.75 80.75,15.75 SR4.5
SR_OUT4_7  (via drill 0.35)
  Top 0.152: v80.5,11.5 80.75,11.25 U4.38 | U4.27 75.25,11.25 v75,11.5
  Route2 0.152: v83.5,14.5 83.5,12 82.75,11.25 80.75,11.25 v80.5,11.5
  Bottom 0.152: v83.5,14.5 83.25,14.5 82,15.75 SR4.6 | v75,11.5 75.25,11.25 77,11.25 77.5,10.75 77.5,9.25 78.5,9.25 78.75,9.5 78.75,11.25 80.25,11.25 v80.5,11.5
SR_OUT4_8  (via drill 0.35)
  Top 0.152: v75.5,6 74.75,6.75 U4.26 | v80.25,7.75 U4.37
  Route15 0.152: v86.25,13.75 v80.25,7.75 80,7.5 80,7.25 78.75,6 v75.5,6
  Bottom 0.152: v86.25,13.75 84.25,13.75 84.25,14.75 83.25,15.75 SR4.7
SR_OUT5_1  (via drill 0.35)
  Top 0.152: v99.5,7.75 99.75,8 U5.36 | v105.25,7.5 U5.47
  Bottom 0.152: SR5.15 97,10.25 97,11.25 98.5,11.25 98.75,11 98.75,8.5 v99.5,7.75 105,7.75 v105.25,7.5
SR_OUT5_2  (via drill 0.35)
  Top 0.152: v107,19.25 107.25,19 107.25,13.25 104.75,10.75 U5.46 | v99.25,13.5 U5.35
  Bottom 0.152: 106.75,19.25 104.5,19.25 103.5,18.25 97.25,18.25 96.75,18.75 92,18.75 92,17 92.5,16.5 95,16.5 95.5,16 SR5.1 | v99.25,13.5 105,13.5 106.75,15.25 106.75,19.25 | 106.75,19.25 v107,19.25
SR_OUT5_3  (via drill 0.35)
  Top 0.152: v98.5,7.75 98.25,8 U5.33 | U5.44 103.75,7.25 v104,7
  Route2 0.152: v93.75,12.75 93.75,12.5 v98.5,7.75
  Route15 0.152: v104,7 101.75,7 100.25,8.5 99.25,8.5 v98.5,7.75
  Bottom 0.152: v93.75,12.75 96.75,15.75 SR5.2
SR_OUT5_4  (via drill 0.35)
  Top 0.152: U5.32 v97.75,6.25 | v103.25,6.25 U5.43
  Route2 0.152: v92.75,17.25 92.75,11.25 v97.75,6.25
  Bottom 0.152: v92.75,17.25 96.75,17.25 98,16 SR5.3 | v97.75,6.25 v103.25,6.25
SR_OUT5_5  (via drill 0.35)
  Top 0.152: v97,13.25 96.75,13 U5.30 96.75,8.25 95,6.5 95,2 101.5,2 102.5,3 102.5,5 102.25,5.25 U5.41
  Route2 0.152: v93.5,18 93.5,16.25 96.5,13.25 v97,13.25
  Bottom 0.152: v93.5,18 93.75,17.75 97.5,17.75 99.25,16 SR5.4
SR_OUT5_6  (via drill 0.35)
  Top 0.152: v96.5,14.25 96.25,14 U5.29 | U5.40 101.75,12.25 v102,12.5
  Route2 0.152: v102,12.5 101.25,12.5 99.5,14.25 v96.5,14.25
  Bottom 0.152: v96.5,14.25 99.25,14.25 100,15 100.5,15 100.5,15.75 SR5.5
SR_OUT5_7  (via drill 0.35)
  Top 0.152: U5.38 v100.75,7 | v95.25,7.75 U5.27
  Route2 0.152: v104.5,18.25 104.5,16 102.75,14.25 102.75,9 v100.75,7
  Bottom 0.152: v104.5,18.25 104.25,18.25 102,16 SR5.6 | v95.25,7.75 96,7 v100.75,7
SR_OUT5_8  (via drill 0.35)
  Top 0.152: v100.5,14.25 100.25,14 100.25,12.5 | U5.37 100.25,12.5 | v94.75,12.5 U5.26 | 100.25,12.5 v100,12.5
  Bottom 0.152: v100.5,14.25 103,14.25 103,15.75 SR5.7 | v100,12.5 v94.75,12.5
VCC_LATCH  (via drill 0.35)
  Top 0.152: U1.7 22.75,13.75 | 22.75,13.75 U1.42 | U1.18 17.25,15 | 17.25,15 U1.31 17.25,5 16.25,4 JP8.2 | 22.75,13.75 19.5,13.75 19.5,14.5 19,15 17.25,15 | U2.7 U2.42 42.75,8.25 42.5,8 42.5,7.5 39.75,4.75 39.75,2.75 | U2.18 U2.31 37.25,5 36.25,4 | 39.75,2.75 39,2 36.25,2 36.25,4 | 36.25,4 JP7.2 | U5.42 U5.7 v102.75,19.5 | JP10.2 96.25,4 96.25,5.75 97.25,6.75 U5.31 97.25,10 98,10.75 98,13.75 97.25,14.5 U5.18 97.25,18.75 v97.5,19 | U3.18 U3.31 57.25,7.25 59,5.5 59,4.25 59.5,3.75 63,3.75 | U3.7 U3.42 62.75,7.5 63,7.25 63,3.75 | U4.7 82.75,14.25 83.25,13.75 83.25,11.75 82.75,11.25 U4.42 82.75,7.75 79.75,4.75 79.75,2.75 79,2 76.25,2 76.25,4 | 76.25,4 77.25,5 U4.31 77.25,10 77.5,10.25 77.5,13 77.25,13.25 U4.18 | 76.25,4 JP9.2 | v64,2.75 63,3.75 | 39.75,2.75 40.25,2.75 41,2 v45.5,2
  Route2 0.152: JP8.2 17.25,4 18.25,5 35,5 36,4 JP7.2
  Route15 0.152: JP10.2 95.25,4 94.25,5 77.25,5 76.25,4 JP9.2
  Bottom 0.152: v102.75,19.5 102.5,19.25 97.75,19.25 v97.5,19 | 64.75,2 v64,2.75 | 64.75,2 74,2 76,4 JP9.2 | 64.75,2 v45.5,2
VCC_SR  (via drill 0.35)
  Top 0.152: v13.5,10 13.5,4 JP8.1 | v33.5,10.25 33.5,4 JP7.1 | v105.5,6.5 105,6 105,3 103.5,1.5 93.75,1.5 | 93.75,1.5 93.75,4 JP10.1 93.5,4 v93.5,9 | 93.75,1.5 73.75,1.5 73.75,4 JP9.1
  Route15 0.152: JP7.1 34.75,4 41.75,11 v46,11
  Bottom 0.152: SR1.16 15.5,10 v13.5,10 12.5,11 1.75,11 1.25,11.5 1.25,12.5 16,12.5 16.25,12.25 21.5,12.25 21.75,12.5 22.5,12.5 24,11 | 24,11 24.25,11.25 25.25,11.25 26.25,10.25 v33.5,10.25 35.5,10.25 SR2.16 | 24,11 23.25,10.25 SR1.10 | 93.5,9.25 94.75,9.25 95.5,10 SR5.16 | 93.5,9.25 84,9.25 83.25,10 SR4.10 | v105.5,6.5 107,6.5 107,7.75 106,8.75 103.25,8.75 103.25,10 SR5.10 | v93.5,9 93.5,9.25 | 46,11.25 46.25,11.25 47.25,10.25 55.5,10.25 SR3.16 55.75,10.25 55.75,12.25 58.25,12.25 58.75,12.75 63,12.75 63.25,12.5 64.75,12.5 65,12.75 65.5,12.75 67,11.25 | 46,11.25 44.25,11.25 43.25,10.25 SR2.10 | 73.75,11.25 74.25,11.25 75.25,10.25 75.5,10.25 SR4.16 | 73.75,11.25 67,11.25 | 67,11.25 64.25,11.25 63.25,10.25 SR3.10 | 73.75,11.25 73.75,4 JP9.1 | 46,11.25 v46,11

### Text on the board
tNames: EN1 | EN2 | SR1_Output1-8 | VCC_SR | VCC_LATCH | GND | DATA_IN | CLK | LATCH_CLK | VCC_SR | VCC_LATCH | GND | DATA_IN | CLK | LATCH_CLK | VCC_SR | VCC_LATCH | GND | DATA_OUT | CLK | LATCH_CLK | VCC_SR | VCC_LATCH | GND | DATA_OUT | CLK | LATCH_CLK
bNames: EN1 | EN2 | 1 | 2 | 3 | 4 | 5 | Hsia & Warren / 20230810 / SR+Latch For RIS v2 | VCC_SR | VCC_LATCH | GND | DATA_IN | CLK | LATCH_CLK | VCC_SR | VCC_LATCH | GND | DATA_IN | CLK | LATCH_CLK | VCC_SR | VCC_LATCH | GND | DATA_OUT | CLK | LATCH_CLK | VCC_SR | VCC_LATCH | GND | DATA_OUT | CLK | LATCH_CLK